# Altium schematic sheet Sensors.SchDoc
size A4; SheetNumber: 2; SheetTotal: 3
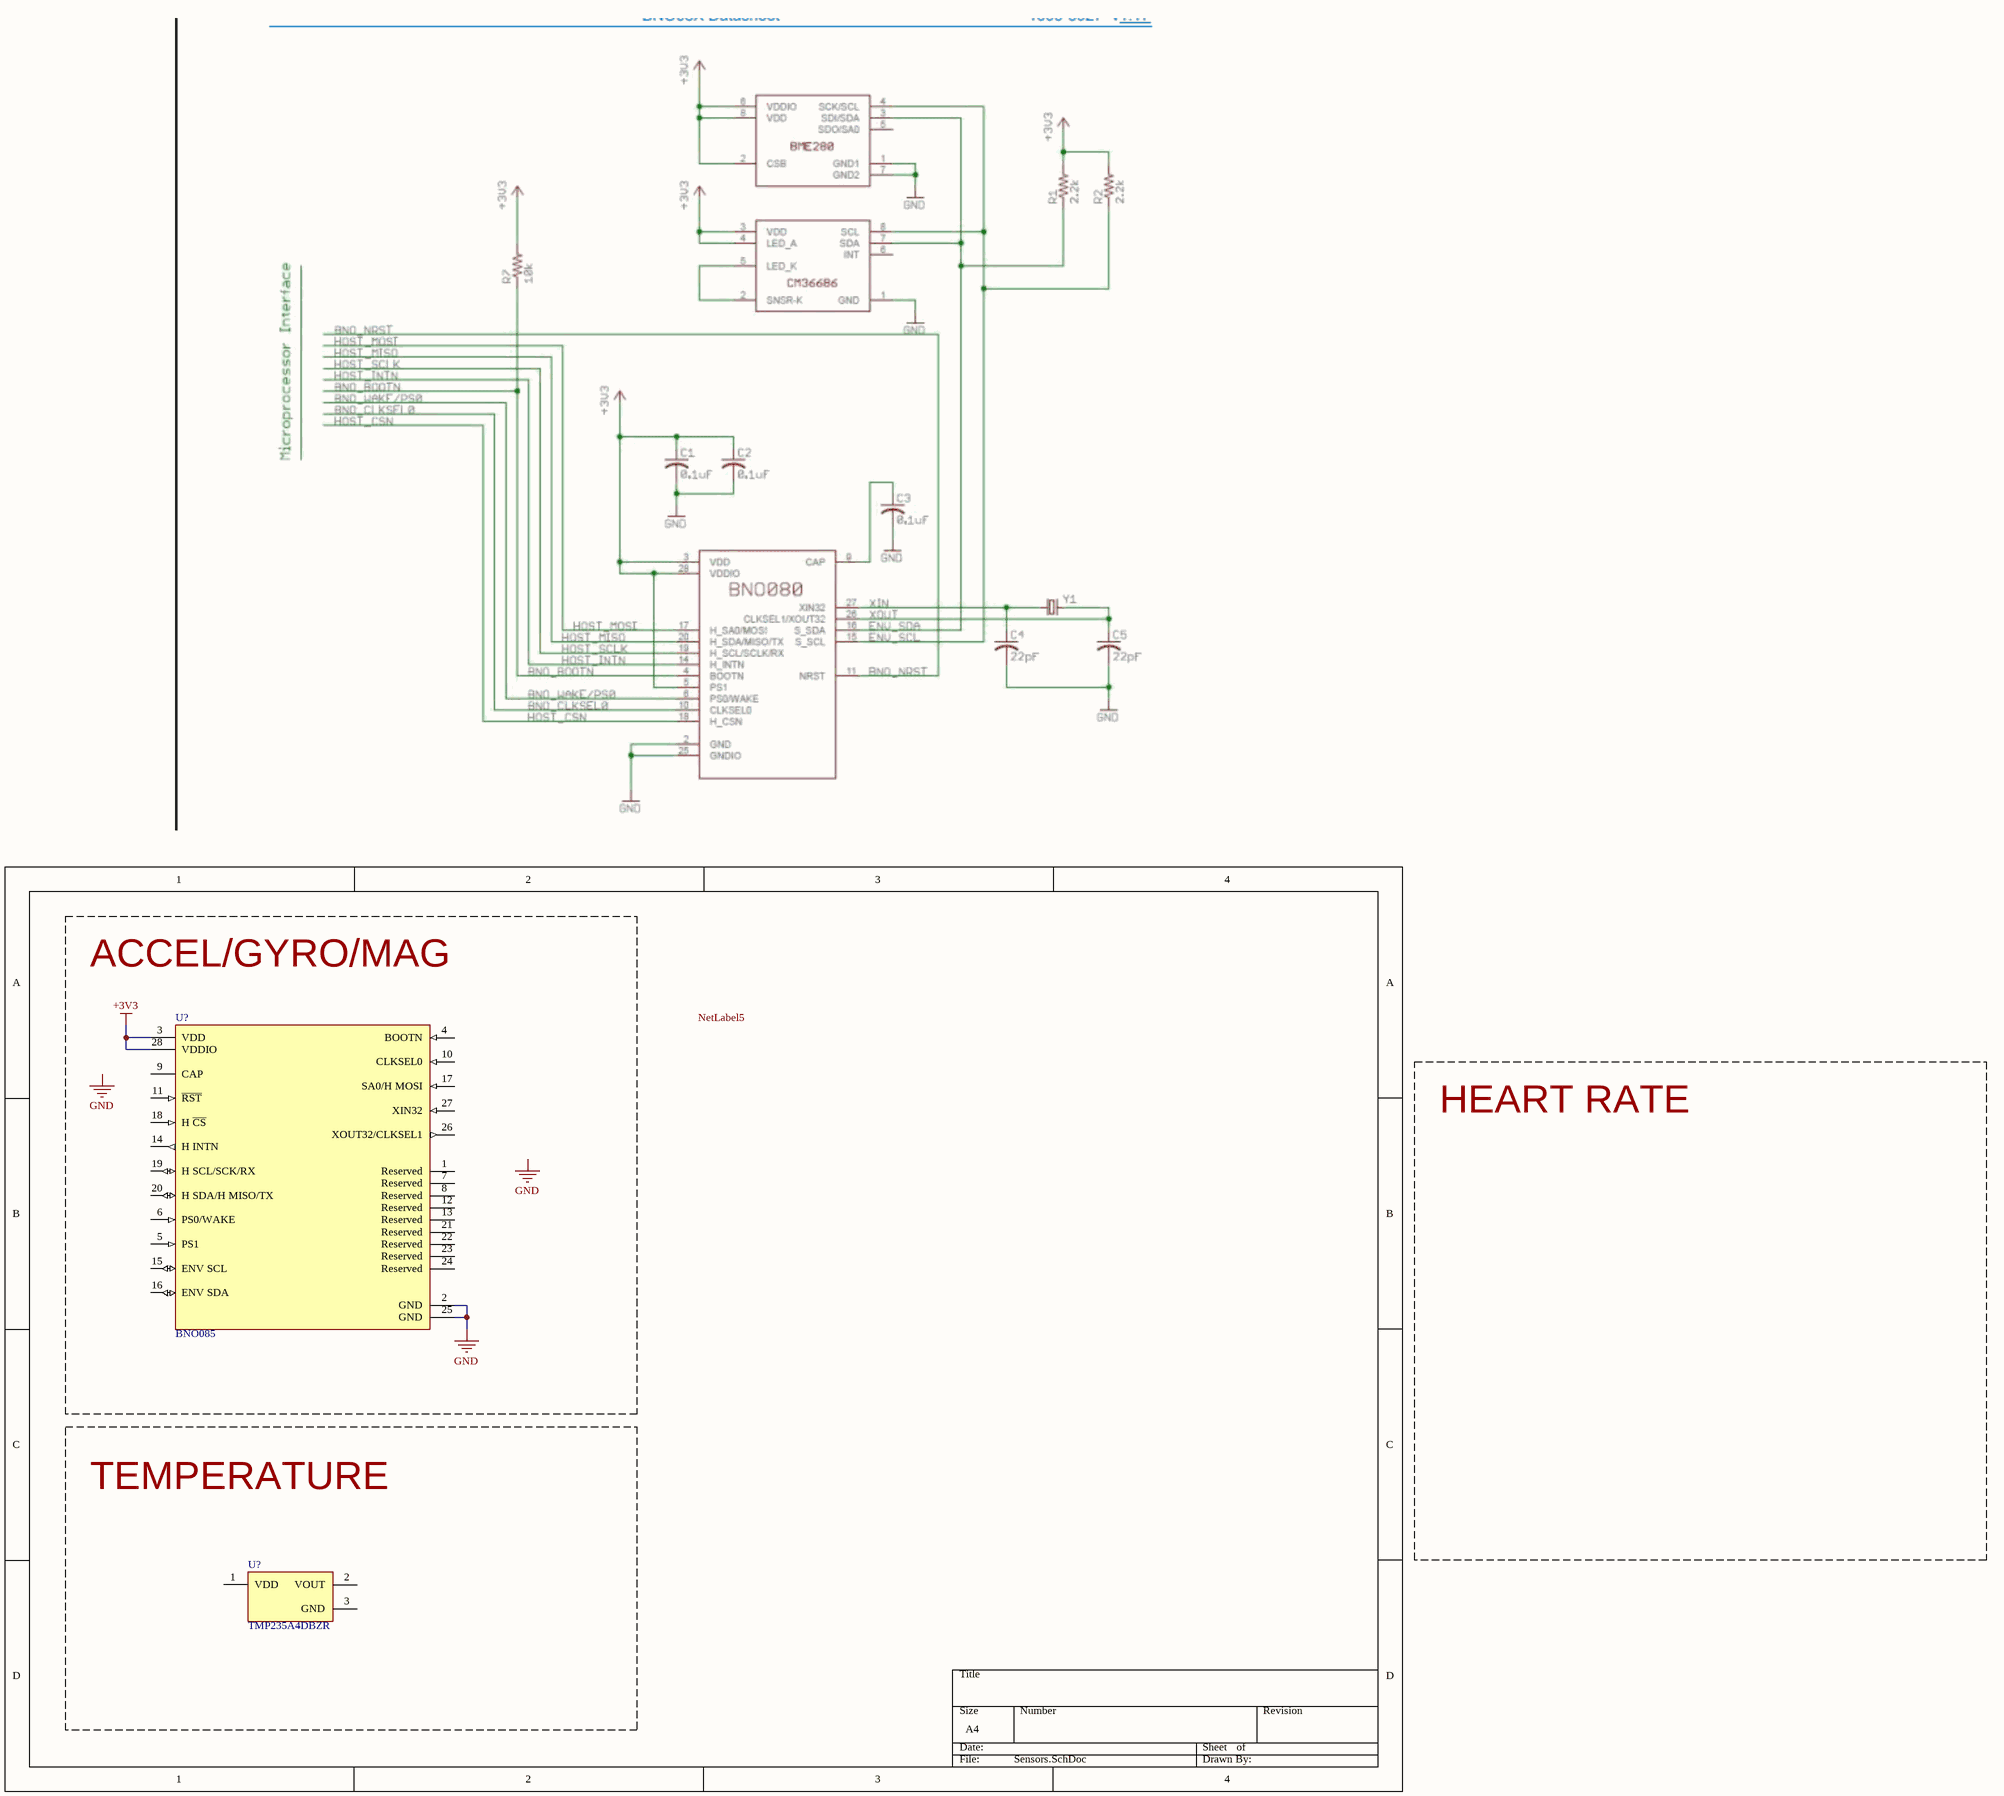
[diagram p0: Sensors.SchDoc]

## Parts
(Parts that share a designator on the sheet are numbered #1, #2 ... from top to bottom, then left to right.)
U?#1  BNO085  [FP-BNO085-MFG]
U?#2  TMP235A4DBZR  [FP-DBZ0003A-MFG]

## Blocks framed on the sheet
ACCEL/GYRO/MAG: U?#1
TEMPERATURE: U?#2

## Nets
+3V3: U?#1.3(VDD) U?#1.28(VDDIO)
GND: U?#1.2(GND) U?#1.25(GND)

Not connected (* = marked no-connect by the designer): U?#1 1(Reserved) 4(BOOTN) 5(PS1) 6(PS0/WAKE) 7(Reserved) 8(Reserved) 9(CAP) 10(CLKSEL0) 11(~{RST}) 12(Reserved) 13(Reserved) 14(H_INTN) 15(ENV_SCL) 16(ENV_SDA) 17(SA0/H_MOSI) 18(H_~{CS}) 19(H_SCL/SCK/RX) 20(H_SDA/H_MISO/TX) 21(Reserved) 22(Reserved) 23(Reserved) 24(Reserved) 26(XOUT32/CLKSEL1) 27(XIN32); U?#2 1(VDD) 2(VOUT) 3(GND)

## Notes on the sheet
- HEART RATE
- Labels drawn without touching a wire or pin: GND, NetLabel5

## Library data of the parts
U?#1 = CMP-197298-000001-1: IMU ACCEL/GYRO/MAG I2C 32BIT; Manufacturer: Hillcrest Laboratories, Inc.; Sensor Type: Accelerometer,Gyroscope,Magnetometer; Max Supply Voltage: 3.6V; Sensor Output: I2C,SPI,UART; Accel Range: 8g; Min Supply Voltage: 1.7V; Temperature Range High: +85°C; ComponentLink2URL: https://www.hillcrestlabs.com/download/5a747b8d566d073a5d000536; Octopart: https://octopart.com/bno085-hillcrest+laboratories-92813482; Height: 1.18mm; Device Class L1: Sensors; Digikey Description: IMU ACCEL/GYRO/MAG I2C 32BIT; Automotive: No; Package: BNO085; Device Class L3: Inertial Measurement Units (IMUs); Temperature: -40°C to +85°C; Category: IC; Device Class L2: Motion Sensors; Lead Free: Yes; Manufacturer Part Number: BNO085; Temperature Range Low: -40°C; RoHS: TRUE; ComponentLink2Description: Datasheet
U?#2 = CMP-04948-000018-1: LOW-POWER HIGH-ACCURACY ANALOG O; Manufacturer: Texas Instruments; Min Supply Voltage: 2.3V; Description: Low-Power, High-Accuracy Analog Output Temperature Sensors; Output Current: 500uA; Operating Supply Current: 9-17uA; Max Supply Voltage: 5.5V; Max Junction Temp: +150°C; Standoff Height: 0.01mm; Sensor Output: Analog Voltage; Temperature Range High: +150°C; Lead Free: Yes; Device Class L1: Sensors; Device Class L3: unset; Automotive: No; ComponentLink2Description: Datasheet; Temperature: -40°C to +150°C; RoHS: TRUE; Manufacturer Part Number: TMP235A4DBZR; Digikey Description: LOW-POWER HIGH-ACCURACY ANALOG O; Ambient Temperature Range High: +150°C; Ambient Temperature Range Low: -40°C; ComponentLink2URL: http://www.ti.com/lit/ds/symlink/tmp235.pdf; Temperature Range Low: -40°C; Device Class L2: Temperature and Humidity Sensors; Category: IC; Mouser Description: ±2.5°C Analog output temperature sensor, with 10mV /°C gain 3-SOT-23 -40 to 150; Height: 1.12mm; Package: DBZ0003A; Octopart: https://octopart.com/tmp235a4dbzr-texas+instruments-94966378